# EAGLE design videopac_cart (EAGLE 7.5.0)
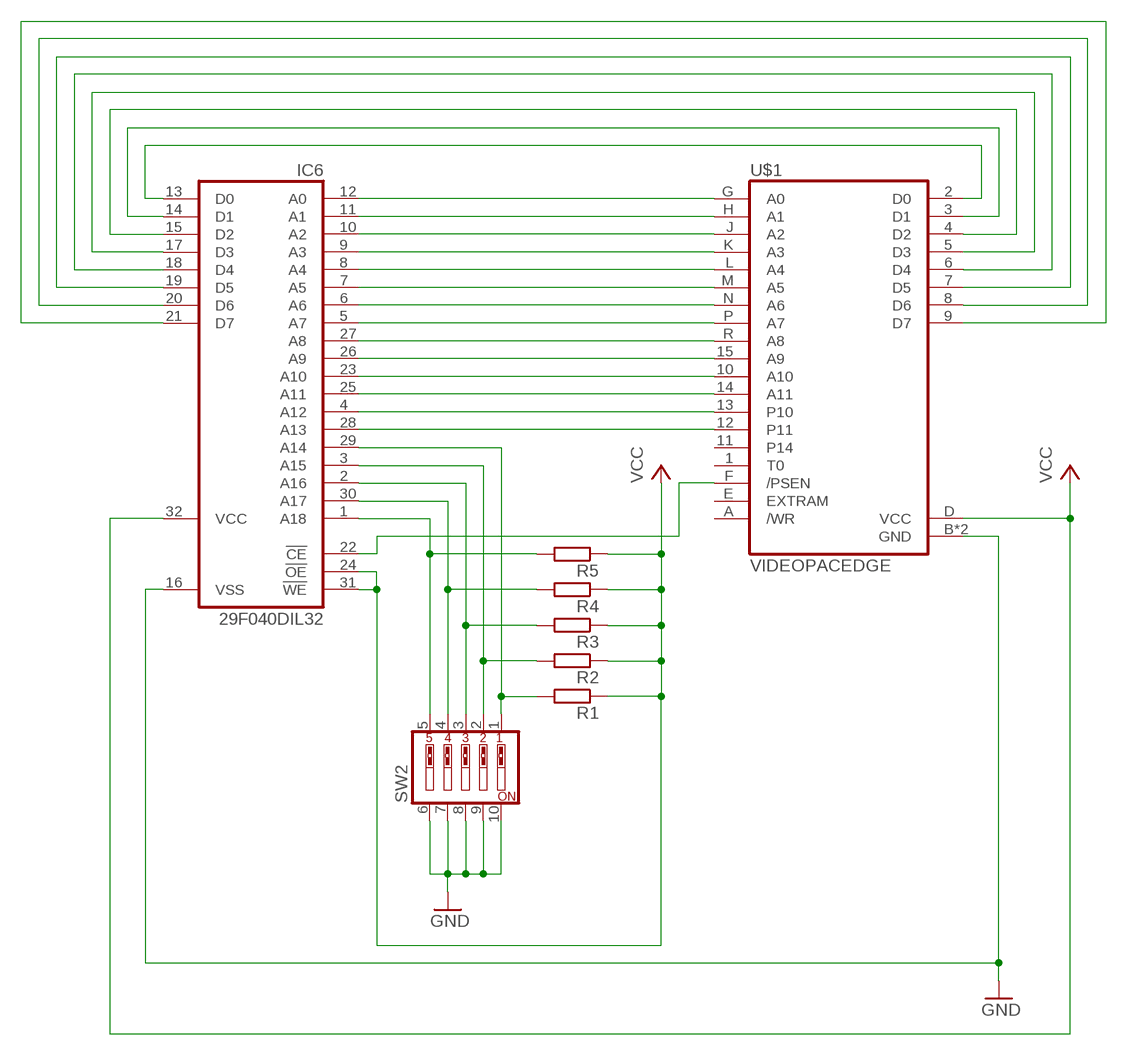
[diagram p0: schematic, sheet 1]

## Parts
IC6  29F040DIL32  [DIL32]
R1  R-EU_0207/10  [0207/10]
R2  R-EU_0207/10  [0207/10]
R3  R-EU_0207/10  [0207/10]
R4  R-EU_0207/10  [0207/10]
R5  R-EU_0207/10  [0207/10]
SW2  SW_DIP-5  [EDG-05]
U$1  VIDEOPACEDGE  [VIDEOPAC]

## Nets
GND: IC6.16(VSS) SW2.6 SW2.7 SW2.8 SW2.9 SW2.10 U$1.B(GND) U$1.C(GND)
N$1: IC6.12(A0) U$1.G(A0)
N$2: IC6.11(A1) U$1.H(A1)
N$3: IC6.10(A2) U$1.J(A2)
N$4: IC6.9(A3) U$1.K(A3)
N$5: IC6.8(A4) U$1.L(A4)
N$6: IC6.7(A5) U$1.M(A5)
N$7: IC6.6(A6) U$1.N(A6)
N$8: IC6.5(A7) U$1.P(A7)
N$9: IC6.27(A8) U$1.R(A8)
N$10: IC6.26(A9) U$1.15(A9)
N$11: IC6.23(A10) U$1.10(A10)
N$12: IC6.25(A11) U$1.14(A11)
N$13: IC6.4(A12) U$1.13(P10)
N$14: IC6.28(A13) U$1.12(P11)
N$15: IC6.29(A14) R1.2 SW2.1
N$16: IC6.3(A15) R2.2 SW2.2
N$17: IC6.2(A16) R3.2 SW2.3
N$18: IC6.30(A17) R4.2 SW2.4
N$19: IC6.1(A18) R5.2 SW2.5
N$20: IC6.22(!CE) U$1.F(/PSEN)
N$21: IC6.13(D0) U$1.2(D0)
N$22: IC6.14(D1) U$1.3(D1)
N$23: IC6.15(D2) U$1.4(D2)
N$24: IC6.17(D3) U$1.5(D3)
N$25: IC6.18(D4) U$1.6(D4)
N$26: IC6.19(D5) U$1.7(D5)
N$27: IC6.20(D6) U$1.8(D6)
N$28: IC6.21(D7) U$1.9(D7)
VCC: IC6.24(!OE) IC6.31(!WE) IC6.32(VCC) R1.1 R2.1 R3.1 R4.1 R5.1 U$1.D(VCC)
Unconnected: U$1.1(T0) U$1.11(P14) U$1.A(/WR) U$1.E(EXTRAM)

## Library data of the parts
IC6 = Mio:29F040
R1-R5 = rcl:R-EU_: RESISTOR, European symbol
SW2 = special:SW_DIP-5: DIP SWITCH
U$1 = BUSES:VIDEOPAC

## Board
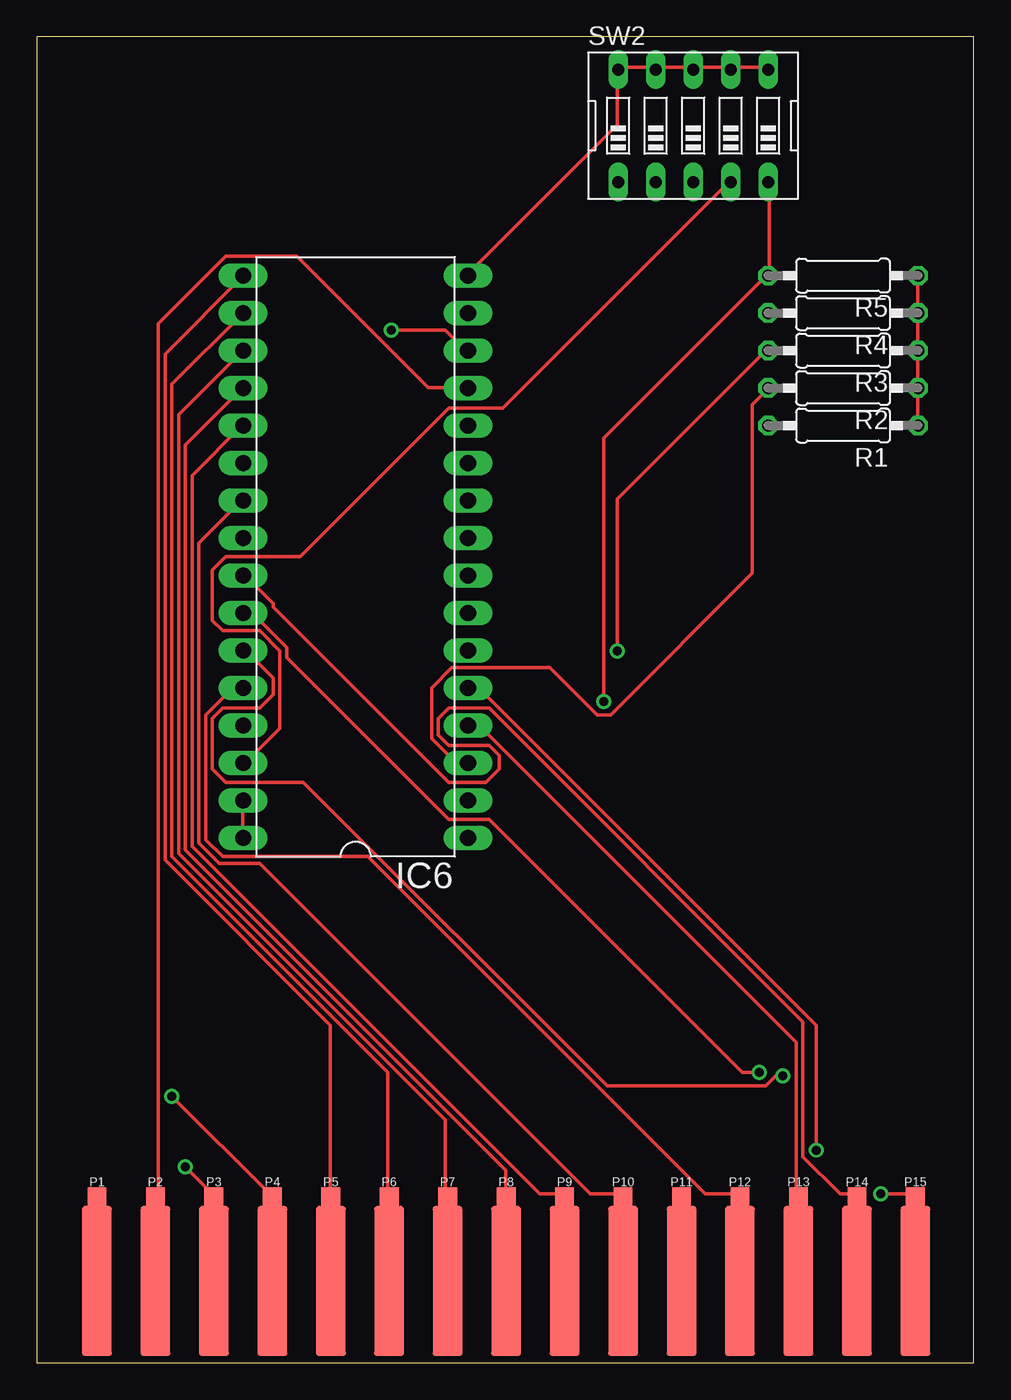
[diagram p1: board, top side]
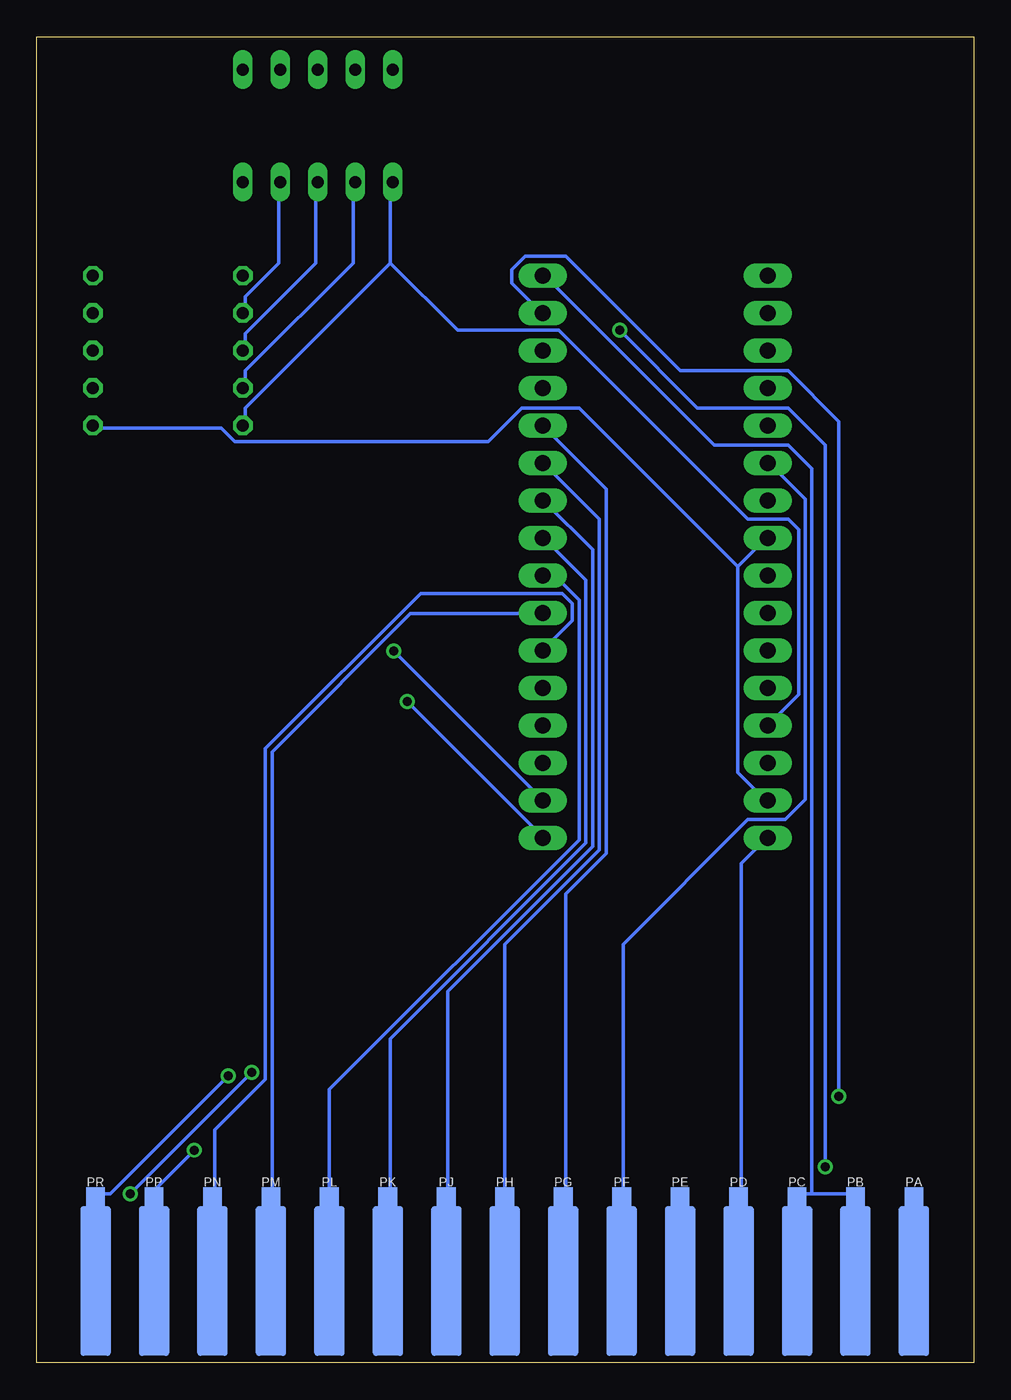
[diagram p2: board, bottom side, seen from below]

Size 63.48 x 89.84 mm. Coordinates in mm from the lower left corner, seen from the top.
Outline: 0,0 63.48,0 63.48,89.84 0,89.84 0,0
Copper layers (1*16): Top 0.035mm / dielectric 1.5mm / Bottom 0.035mm
Design rules "default": minimum track width 10mil, minimum drill 24mil, track to track 8mil, track to pad 8mil, pad to pad 8mil, via to via 8mil, smd to smd 8mil, copper to edge 40mil, drill to drill 8mil, minimum pad ring 10mil, minimum via ring 8mil, stop-mask expansion 4mil, vias tented up to drill 0mil, thermal gap 10mil

### Footprints (pad centres in the part's own frame; a part is rotated, then mirrored left to right if it is on the bottom)
DIL32 = drill 1.1 long: 1 -21.59,-8.89; 2 -19.05,-8.89; 3 -16.51,-8.89; 4 -13.97,-8.89; 5 -11.43,-8.89; 6 -8.89,-8.89; 7 -6.35,-8.89; 8 -3.81,-8.89; 9 -1.27,-8.89; 10 1.27,-8.89; 11 3.81,-8.89; 12 6.35,-8.89; 13 8.89,-8.89; 14 11.43,-8.89; 15 13.97,-8.89; 16 16.51,-8.89; 17 16.51,6.35; 18 13.97,6.35; 19 11.43,6.35; 20 8.89,6.35; 21 6.35,6.35; 22 3.81,6.35; 23 1.27,6.35; 24 -1.27,6.35; 25 -3.81,6.35; 26 -6.35,6.35; 27 -8.89,6.35; 28 -11.43,6.35; 29 -13.97,6.35; 30 -16.51,6.35; 31 -19.05,6.35; 32 -21.59,6.35
0207/10 = drill 0.813 octagon: 1 -5.08,0; 2 5.08,0
EDG-05 = drill 0.813 long: 1 -5.08,-3.81; 2 -2.54,-3.81; 3 0,-3.81; 4 2.54,-3.81; 5 5.08,-3.81; 6 5.08,3.81; 7 2.54,3.81; 8 0,3.81; 9 -2.54,3.81; 10 -5.08,3.81
VIDEOPAC = smd 1.27 x 1.27: 1 -27.683,6.167; 2 -23.723,6.167; 3 -19.763,6.167; 4 -15.803,6.167; 5 -11.843,6.167; 6 -7.883,6.167; 7 -3.923,6.167; 8 0.037,6.167; 9 3.997,6.167; 10 7.957,6.167; 11 11.917,6.167; 12 15.877,6.167; 13 19.837,6.167; 14 23.797,6.167; 15 27.757,6.167 | smd 1.27 x 1.27 bottom: A -27.683,6.167; B -23.723,6.167; C -19.763,6.167; D -15.803,6.167; E -11.843,6.167; F -7.883,6.167; G -3.923,6.167; H 0.037,6.167; J 3.997,6.167; K 7.957,6.167; L 11.917,6.167; M 15.877,6.167; N 19.837,6.167; P 23.797,6.167; R 27.757,6.167 | smd 2.032 x 10.16: P$1 -27.683,0.452; P$2 -23.723,0.452; P$3 -19.763,0.452; P$4 -15.803,0.452; P$5 -11.843,0.452; P$6 -7.883,0.452; P$7 -3.923,0.452; P$8 0.037,0.452; P$9 3.997,0.452; P$10 7.957,0.452; P$11 11.917,0.452; P$12 15.877,0.452; P$13 19.837,0.452; P$14 23.797,0.452; P$15 27.757,0.452 | smd 2.032 x 10.16 bottom: P$A -27.683,0.452; P$B -23.723,0.452; P$C -19.763,0.452; P$D -15.803,0.452; P$E -11.843,0.452; P$F -7.883,0.452; P$H -3.923,0.452; P$J 0.037,0.452; P$K 3.997,0.452; P$L 7.957,0.452; P$M 11.917,0.452; P$N 15.877,0.452; P$P 19.837,0.452; P$R 23.797,0.452; P$S 27.757,0.452

### Placement (x,y rotation side)
IC6  20.32,57.15 90 top
R1  54.61,63.5 180 top
R2  54.61,66.04 180 top
R3  54.61,68.58 180 top
R4  54.61,71.12 180 top
R5  54.61,73.66 180 top
SW2  44.45,83.82 0 top
U$1  31.75,5.08 0 top

### Tracks (layer width: path | path; a pad name or v marks a point on that pad's centre or on a via)
GND
  Top 0.254: SW2.6 49.38,87.78 47.09,87.78 SW2.7 46.86,87.78 44.58,87.78 SW2.8 44.35,87.78 42.06,87.78 SW2.9 41.83,87.78 39.55,87.78 SW2.10 39.32,87.55 39.32,83.9 29.26,73.84 IC6.16
  Bottom 0.254: 10.97,11.43 11.89,11.43 U$1.C | 10.97,11.43 8.23,11.43 U$1.B | 10.97,11.43 10.97,60.58 12.57,62.18 17.6,62.18 29.03,73.61 IC6.16
N$1
  Bottom 0.254: IC6.12 24.92,59.21 24.92,34.52 27.66,31.77 27.66,11.43 U$1.G
N$2
  Bottom 0.254: U$1.H 31.77,11.43 31.77,28.35 25.38,34.75 25.38,57.15 29.03,60.81 IC6.11
N$3
  Bottom 0.254: U$1.J 35.66,11.43 35.66,25.15 25.83,34.98 25.83,55.09 29.03,58.29 IC6.10
N$4
  Bottom 0.254: U$1.K 39.55,11.43 39.55,21.95 26.29,35.2 26.29,53.03 29.03,55.78 IC6.9
N$5
  Bottom 0.254: U$1.L 43.66,11.43 43.66,18.52 26.75,35.43 26.75,51.66 28.35,53.26 29.03,53.26 IC6.8
N$6
  Bottom 0.254: U$1.M 47.55,11.43 47.55,41.38 38.18,50.75 29.26,50.75 IC6.7
N$7
  Bottom 0.254: U$1.N 51.44,11.43 51.44,15.77 48.01,19.2 48.01,41.6 37.49,52.12 27.89,52.12 27.2,51.44 27.2,50.29 29.03,48.46 IC6.6
N$8  (via drill 0.61)
  Top 0.254: v52.81,14.4 52.81,22.86 29.95,45.72 IC6.5
  Bottom 0.254: v52.81,14.4 55.32,11.89 55.32,11.43 U$1.P
N$9  (via drill 0.61)
  Top 0.254: v50.52,19.43 50.06,19.43 49.38,18.75 38.63,18.75 18.06,39.32 12.8,39.32 11.89,40.23 11.89,43.66 12.57,44.35 15.09,44.35 16,45.26 16,46.41 14.17,48.23 IC6.27
  Bottom 0.254: v50.52,19.43 58.52,11.43 59.44,11.43 U$1.R
N$10  (via drill 0.61)
  Top 0.254: v57.15,11.43 59.44,11.43 U$1.15 | v48.92,19.66 47.78,19.66 30.63,36.8 27.89,36.8 16.92,47.78 16.92,48.46 14.63,50.75 14.17,50.75 IC6.26
  Bottom 0.254: v48.92,19.66 v57.15,11.43
N$11
  Top 0.254: U$1.10 39.55,11.43 37.49,11.43 15.09,33.83 12.34,33.83 10.97,35.2 10.97,55.55 13.95,58.52 IC6.23
N$12
  Top 0.254: U$1.14 55.32,11.43 54.41,11.43 51.89,13.95 51.89,23.09 30.63,44.35 27.89,44.35 27.2,43.66 27.2,42.52 27.89,41.83 30.63,41.83 31.32,41.15 31.32,40.23 30.4,39.32 27.89,39.32 16,51.21 16,51.44 14.17,53.26 IC6.25
N$13
  Top 0.254: U$1.13 51.44,11.43 51.44,21.72 30.18,42.98 29.26,42.98 IC6.4
N$14
  Top 0.254: IC6.28 13.26,45.72 11.43,43.89 11.43,35.43 12.57,34.29 22.4,34.29 45.26,11.43 47.55,11.43 U$1.12
N$15
  Bottom 0.254: 39.55,74.52 49.38,64.69 49.38,63.55 R1.2 | 39.55,74.52 39.55,80.01 SW2.1 | IC6.29 11.89,45.26 11.89,56.46 12.57,57.15 15.32,57.15 28.12,69.95 34.98,69.95 39.55,74.52
N$16
  Top 0.254: IC6.3 29.03,40.69 28.35,40.69 26.75,42.29 26.75,45.72 28.12,47.09 34.75,47.09 37.95,43.89 38.86,43.89 48.46,53.49 48.46,64.92 49.38,65.84 R2.2
  Bottom 0.254: R2.2 49.38,66.06 49.38,67.21 42.06,74.52 42.06,80.01 SW2.2
N$17  (via drill 0.61)
  Top 0.254: v39.32,48.23 39.32,58.52 49.38,68.58 R3.2
  Bottom 0.254: R3.2 49.38,68.58 49.38,69.72 44.58,74.52 44.58,80.01 SW2.3 | v39.32,48.23 29.26,38.18 IC6.2
N$18
  Top 0.254: IC6.30 14.17,40.69 16.46,42.98 16.46,48.23 15.09,49.61 12.57,49.61 11.89,50.29 11.89,53.72 12.8,54.63 17.83,54.63 27.89,64.69 31.55,64.69 46.86,80.01 SW2.4
  Bottom 0.254: R4.2 49.38,71.32 49.38,72.24 47.09,74.52 47.09,80.01 SW2.4
N$19  (via drill 0.61)
  Top 0.254: SW2.5 49.61,80.01 49.61,73.84 R5.2 49.38,73.61 38.41,62.64 v38.41,44.81
  Bottom 0.254: v38.41,44.81 29.26,35.66 IC6.1
N$20
  Bottom 0.254: U$1.F 23.77,11.43 23.77,28.35 15.32,36.8 12.8,36.8 11.43,38.18 11.43,58.52 13.95,61.04 IC6.22
N$21
  Top 0.254: U$1.2 8.23,11.43 8.23,70.41 12.8,74.98 17.6,74.98 26.52,66.06 29.03,66.06 IC6.13
N$22  (via drill 0.61)
  Top 0.254: v10.06,13.26 11.89,11.43 U$1.3 | v24,69.95 27.66,69.95 29.03,68.58 IC6.14
  Bottom 0.254: v10.06,13.26 10.06,62.18 12.57,64.69 18.75,64.69 v24,69.95
N$23  (via drill 0.61)
  Top 0.254: v9.14,18.06 15.77,11.43 U$1.4
  Bottom 0.254: v9.14,18.06 9.14,63.78 12.57,67.21 19.89,67.21 27.66,74.98 30.4,74.98 31.32,74.07 31.32,73.15 29.26,71.09 IC6.15
N$24
  Top 0.254: U$1.5 19.89,11.43 19.89,22.86 8.69,34.06 8.69,68.35 13.95,73.61 IC6.17
N$25
  Top 0.254: IC6.18 9.14,66.29 9.14,34.29 23.77,19.66 23.77,11.43 U$1.6
N$26
  Top 0.254: U$1.7 27.66,11.43 27.66,16.46 9.6,34.52 9.6,64.24 13.95,68.58 IC6.19
N$27
  Top 0.254: U$1.8 31.77,11.43 31.77,13.03 10.06,34.75 10.06,62.18 13.95,66.06 IC6.20
N$28
  Top 0.254: U$1.9 35.66,11.43 34.06,11.43 10.52,34.98 10.52,60.12 13.95,63.55 IC6.21
VCC
  Top 0.254: R1.1 59.66,63.55 59.66,65.84 R2.1 59.66,66.06 59.66,68.58 | 59.66,68.58 59.66,71.09 R4.1 59.66,71.32 59.66,73.61 R5.1 | 59.66,68.58 R3.1 | IC6.31 13.95,37.95 13.95,35.66 IC6.32
  Bottom 0.254: U$1.D 15.77,11.43 15.77,33.83 14.17,35.43 IC6.32 | 16,53.95 14.17,55.78 IC6.24 | 16,53.95 16,40.01 14.17,38.18 IC6.31 | 16,53.95 26.75,64.69 30.63,64.69 32.92,62.41 50.06,62.41 50.98,63.32 59.66,63.32 R1.1